# EAGLE board aleph (EAGLE 6.4), part 1 of 3
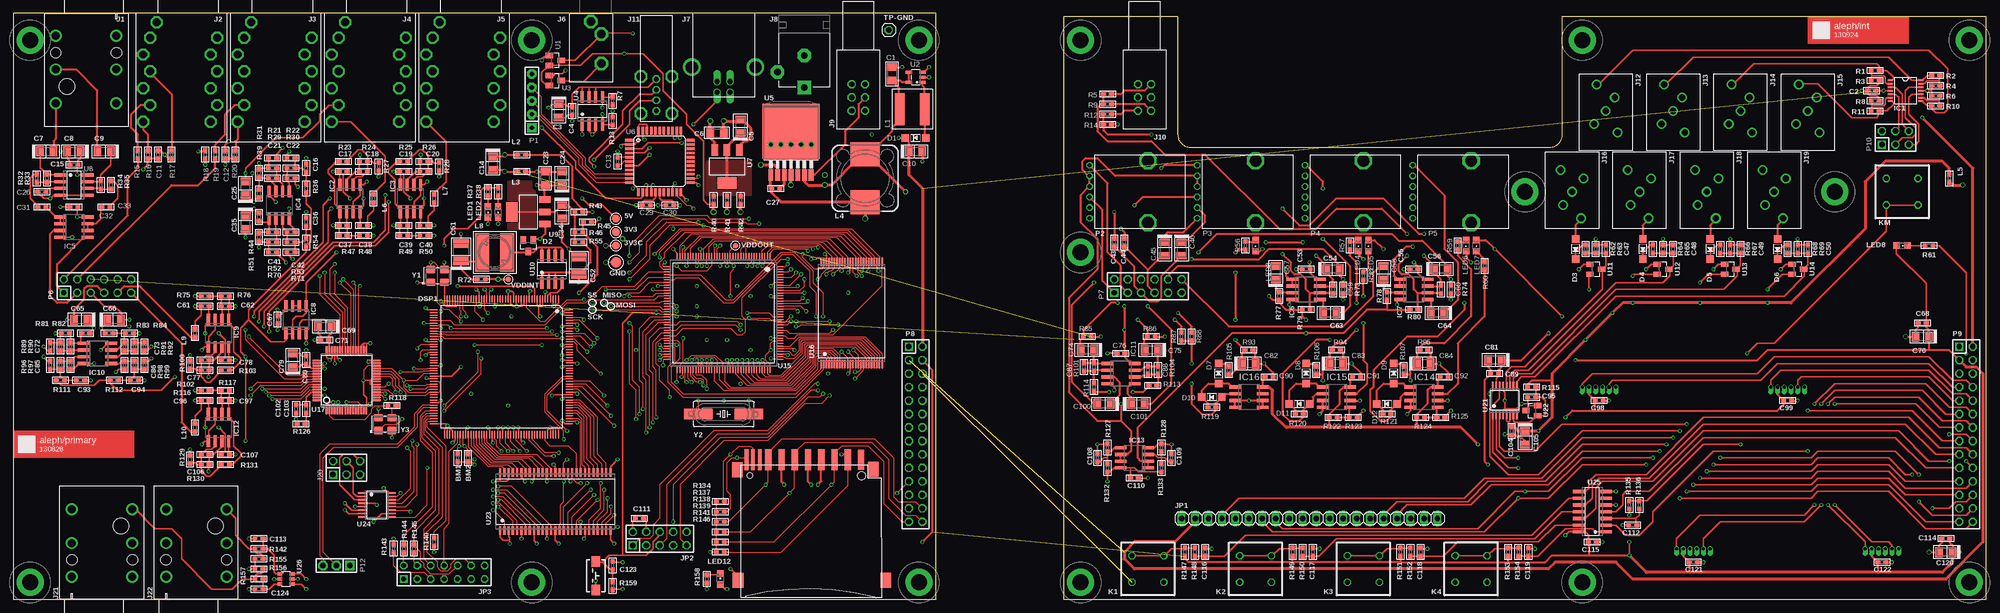
[diagram p10: board, top side]
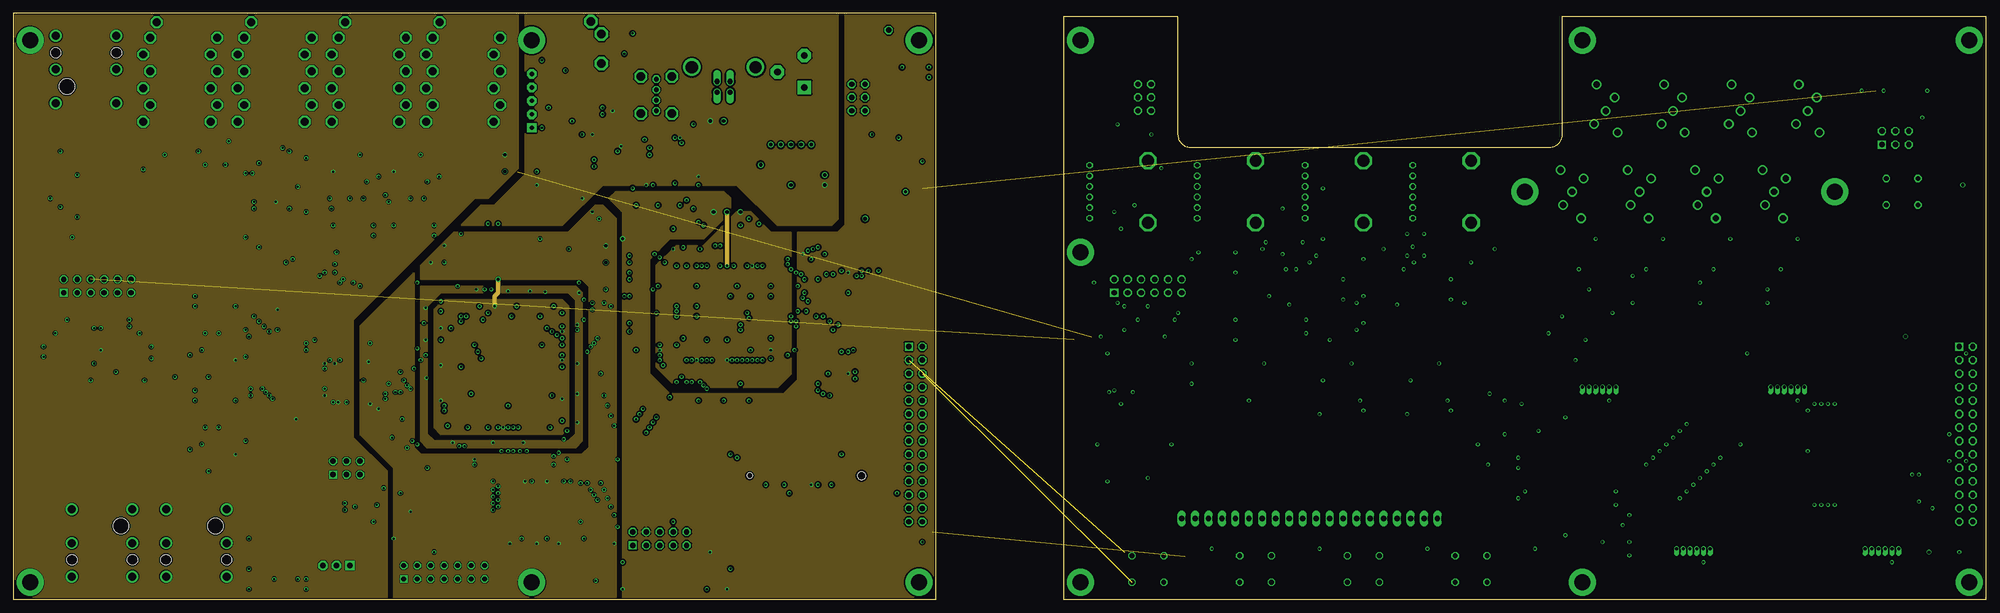
[diagram p11: board, inner layer power]
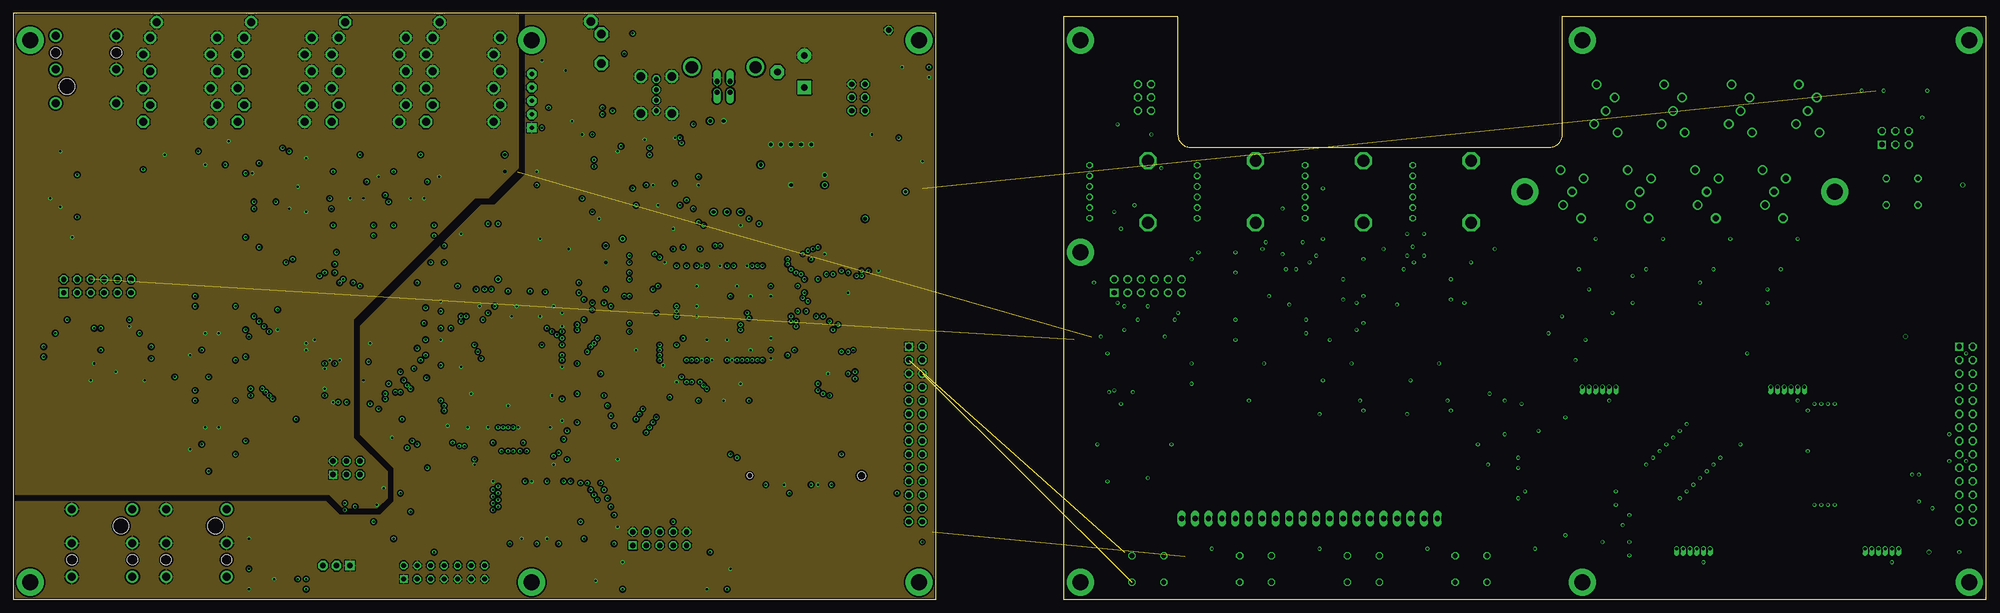
[diagram p12: board, inner layer gnd]
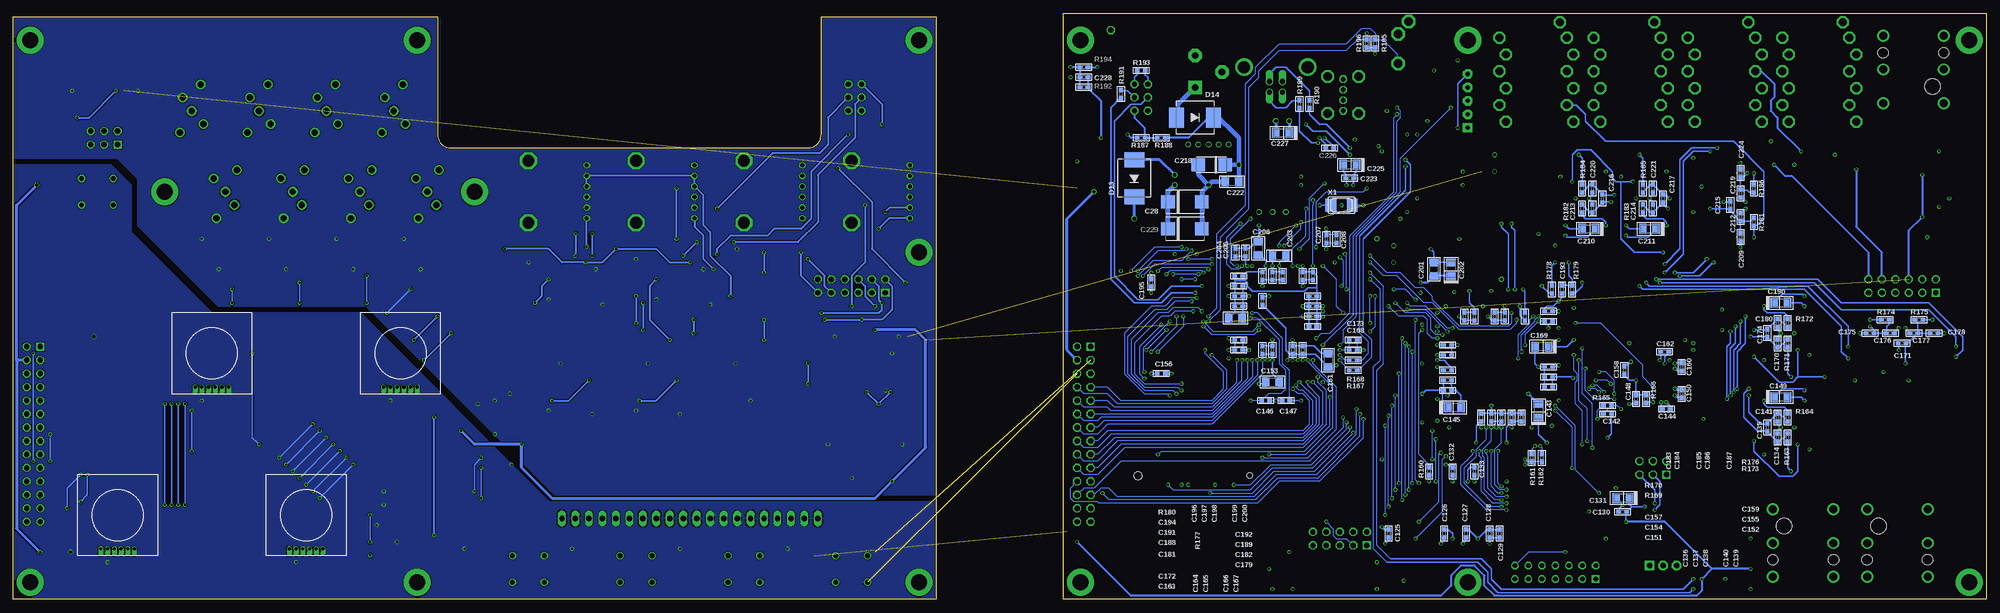
[diagram p13: board, bottom side, seen from below]

Size 372.11 x 110.49 mm. Coordinates in mm from the lower left corner, seen from the top.
Outline: 0,0 173.99,0 173.99,110.49 0,110.49 0,0
Outline: 198.12,0 372.11,0 372.11,109.86 292.1,109.86 292.1,87.63 arc-90 289.56,85.09 222.25,85.09 arc-90 219.71,87.63 219.71,109.86 198.12,109.86 198.12,0
Copper layers (1*2+3*16): Top 0.035mm / dielectric 1.5mm / power 0.035mm / dielectric 0.15mm / gnd 0.035mm / dielectric 0.2mm / Bottom 0.035mm
Design rules "default *": minimum track width 6mil, minimum drill 15mil, track to track 6mil, track to pad 6mil, pad to pad 6mil, via to via 6mil, smd to smd 6mil, copper to edge 10mil, drill to drill 8mil, minimum pad ring 6mil, minimum via ring 6mil, stop-mask expansion 4mil, vias tented up to drill 0mil, thermal gap 10mil

## Footprints (pad centres in the part's own frame; a part is rotated, then mirrored left to right if it is on the bottom)
SMD-15R = smd 1.5 x 1.5: TP 0,0
R0603 = smd 0.9 x 0.8: 1 -0.762,0; 2 0.762,0
C1206 = smd 1.4 x 1.8: 1 -1.27,0; 2 1.27,0
C0603 = smd 0.9 x 0.8: 1 -0.762,0; 2 0.762,0
C1206/T = smd 1.4 x 1.9: + 1.27,0; - -1.27,0
C7343-43 = smd 2.6 x 2.4: + 3.175,0; - -3.175,0
C1210/T = smd 1.6 x 3: + 1.651,0; - -1.651,0
C6032-28/T = smd 2.55 x 2.5: + 2.54,0; - -2.54,0
SOD123 = smd 1.4 x 1.4: A 1.905,0; C -1.905,0
SOT23 = smd 1 x 1.4: 1 -0.95,-1.1; 2 0.95,-1.1; 3 0,1.1
SMC = smd 2.8 x 3.8: A 3.493,0; C -3.493,0
LQFP176 = smd 1.5 x 0.25: P$1 -12.8,10.75; P$2 -12.8,10.25; P$3 -12.8,9.75; P$4 -12.8,9.25; P$5 -12.8,8.75; P$6 -12.8,8.25; P$7 -12.8,7.75; P$8 -12.8,7.25; P$9 -12.8,6.75; P$10 -12.8,6.25; P$11 -12.8,5.75; P$12 -12.8,5.25; P$13 -12.8,4.75; P$14 -12.8,4.25; P$15 -12.8,3.75; P$16 -12.8,3.25; P$17 -12.8,2.75; P$18 -12.8,2.25; P$19 -12.8,1.75; P$20 -12.8,1.25; P$21 -12.8,0.75; P$22 -12.8,0.25; P$23 -12.8,-0.25; P$24 -12.8,-0.75; P$25 -12.8,-1.25; P$26 -12.8,-1.75; P$27 -12.8,-2.25; P$28 -12.8,-2.75; P$29 -12.8,-3.25; P$30 -12.8,-3.75; P$31 -12.8,-4.25; P$32 -12.8,-4.75; P$33 -12.8,-5.25; P$34 -12.8,-5.75; P$35 -12.8,-6.25; P$36 -12.8,-6.75; P$37 -12.8,-7.25; P$38 -12.8,-7.75; P$39 -12.8,-8.25; P$40 -12.8,-8.75; P$41 -12.8,-9.25; P$42 -12.8,-9.75; P$43 -12.8,-10.25; P$44 -12.8,-10.75; P$89 12.8,-10.75; P$90 12.8,-10.25; P$91 12.8,-9.75; P$92 12.8,-9.25; P$93 12.8,-8.75; P$94 12.8,-8.25; P$95 12.8,-7.75; P$96 12.8,-7.25; P$97 12.8,-6.75; P$98 12.8,-6.25; P$99 12.8,-5.75; P$100 12.8,-5.25; P$101 12.8,-4.75; P$102 12.8,-4.25; P$103 12.8,-3.75; P$104 12.8,-3.25; P$105 12.8,-2.75; P$106 12.8,-2.25; P$107 12.8,-1.75; P$108 12.8,-1.25; P$109 12.8,-0.75; P$110 12.8,-0.25; P$111 12.8,0.25; P$112 12.8,0.75; P$113 12.8,1.25; P$114 12.8,1.75; P$115 12.8,2.25; P$116 12.8,2.75; P$117 12.8,3.25; P$118 12.8,3.75; P$119 12.8,4.25; P$120 12.8,4.75; P$121 12.8,5.25; P$122 12.8,5.75; P$123 12.8,6.25; P$124 12.8,6.75; P$125 12.8,7.25; P$126 12.8,7.75; P$127 12.8,8.25; P$128 12.8,8.75; P$129 12.8,9.25; P$130 12.8,9.75; P$131 12.8,10.25; P$132 12.8,10.75 | smd 0.25 x 1.5: P$45 -10.75,-12.8; P$46 -10.25,-12.8; P$47 -9.75,-12.8; P$48 -9.25,-12.8; P$49 -8.75,-12.8; P$50 -8.25,-12.8; P$51 -7.75,-12.8; P$52 -7.25,-12.8; P$53 -6.75,-12.8; P$54 -6.25,-12.8; P$55 -5.75,-12.8; P$56 -5.25,-12.8; P$57 -4.75,-12.8; P$58 -4.25,-12.8; P$59 -3.75,-12.8; P$60 -3.25,-12.8; P$61 -2.75,-12.8; P$62 -2.25,-12.8; P$63 -1.75,-12.8; P$64 -1.25,-12.8; P$65 -0.75,-12.8; P$66 -0.25,-12.8; P$67 0.25,-12.8; P$68 0.75,-12.8; P$69 1.25,-12.8; P$70 1.75,-12.8; P$71 2.25,-12.8; P$72 2.75,-12.8; P$73 3.25,-12.8; P$74 3.75,-12.8; P$75 4.25,-12.8; P$76 4.75,-12.8; P$77 5.25,-12.8; P$78 5.75,-12.8; P$79 6.25,-12.8; P$80 6.75,-12.8; P$81 7.25,-12.8; P$82 7.75,-12.8; P$83 8.25,-12.8; P$84 8.75,-12.8; P$85 9.25,-12.8; P$86 9.75,-12.8; P$87 10.25,-12.8; P$88 10.75,-12.8; P$133 10.75,12.8; P$134 10.25,12.8; P$135 9.75,12.8; P$136 9.25,12.8; P$137 8.75,12.8; P$138 8.25,12.8; P$139 7.75,12.8; P$140 7.25,12.8; P$141 6.75,12.8; P$142 6.25,12.8; P$143 5.75,12.8; P$144 5.25,12.8; P$145 4.75,12.8; P$146 4.25,12.8; P$147 3.75,12.8; P$148 3.25,12.8; P$149 2.75,12.8; P$150 2.25,12.8; P$151 1.75,12.8; P$152 1.25,12.8; P$153 0.75,12.8; P$154 0.25,12.8; P$155 -0.25,12.8; P$156 -0.75,12.8; P$157 -1.25,12.8; P$158 -1.75,12.8; P$159 -2.25,12.8; P$160 -2.75,12.8; P$161 -3.25,12.8; P$162 -3.75,12.8; P$163 -4.25,12.8; P$164 -4.75,12.8; P$165 -5.25,12.8; P$166 -5.75,12.8; P$167 -6.25,12.8; P$168 -6.75,12.8; P$169 -7.25,12.8; P$170 -7.75,12.8; P$171 -8.25,12.8; P$172 -8.75,12.8; P$173 -9.25,12.8; P$174 -9.75,12.8; P$175 -10.25,12.8; P$176 -10.75,12.8
BOURNS-EM14 = drill 0.6 pad 0.813 offset: P$1 -3.175,-6.35; P$2 -1.905,-6.35; P$3 -0.635,-6.35; P$4 0.635,-6.35; P$5 1.905,-6.35; P$6 3.175,-6.35
SMD-20R = smd 2 x 2: TP 0,0
120-PAD-NS = drill 3.048 pad 5.08: B120 0,0
TSSOP14 = smd 0.9 x 0.35: 1 -2.875,1.95; 2 -2.875,1.3; 3 -2.875,0.65; 4 -2.875,0; 5 -2.875,-0.65; 6 -2.875,-1.3; 7 -2.875,-1.95; 8 2.875,-1.95; 9 2.875,-1.3; 10 2.875,-0.65; 11 2.875,0; 12 2.875,0.65; 13 2.875,1.3; 14 2.875,1.95
SO8 = smd 0.6 x 2.2: 1 -1.905,-2.6; 2 -0.635,-2.6; 3 0.635,-2.6; 4 1.905,-2.6; 5 1.905,2.6; 6 0.635,2.6; 7 -0.635,2.6; 8 -1.905,2.6
NEUTRIK-NRJ6HF-1 = drill 1.5: R 7.23,10.6; RN -4.2,10.6; S 7.23,4.25; SN -4.2,4.25; T 7.23,16.95; TN -4.2,16.95 | hole 3: 5.1,13.8 | hole 2: 7.23,7.45; -4.2,7.45
NSJ12HF = drill 1.5 octagon: G -1.73,5.96; RB -10.95,7.23; RNB -10.95,-5.47; RNT -14.13,-4.2; RT -14.13,8.5; SB -4.606,7.23; SNB -4.606,-5.47; SNT -7.78,-4.2; ST -7.78,8.5; TB -17.3,7.23; TNB -17.3,-5.47; TNT -20.48,-4.2; TT -20.48,8.5
SJ1-3533NG = drill 1.6 pad 2.54 octagon: 1 -1,-0.9; 2 1.4,1.1; 3 6.9,1.1
USB_B = drill 0.95 offset: DM -1.25,4.71; DP -1.25,2.71; GND 1.25,2.71; VCC 1.25,4.71 | drill 2.3: MOUNT1 -6,0; MOUNT2 6,0
PJ-102XH = drill 1.245 pad 2.54 square: 1 0,0 | drill 1.245 pad 2.54 octagon: 2 0,-6.032; 3 5.08,-2.857
PHA2U = drill 1 octagon: 0 -1.25,0; 1 -1.25,-2.5; 2 -1.25,2.5; _0 1.25,0; _1 1.25,-2.5; _2 1.25,2.5
USBA-VERT = drill 0.92 octagon: 1 0,-6; 2 0,-4; 3 0,-2; 4 0,0 | drill 1.6 octagon: G1 -2.9,0.5; G2 -2.9,-6.5; G3 2.9,-6.5; G4 2.9,0.5
STX-3680 = drill 1.2: 1 2.2,-4.1; 2 -2.2,-2.5; 3 1.7,2.5; 4 -1.7,5; 5 0,0
DIL-100-2X03 = drill 1.016 square: 1 -2.54,-1.27 | drill 1.016 octagon: 2 -2.54,1.27; 3 0,-1.27; 4 0,1.27; 5 2.54,-1.27; 6 2.54,1.27
1X20 = drill 1.016 long: 1 -24.13,0; 2 -21.59,0; 3 -19.05,0; 4 -16.51,0; 5 -13.97,0; 6 -11.43,0; 7 -8.89,0; 8 -6.35,0; 9 -3.81,0; 10 -1.27,0; 11 1.27,0; 12 3.81,0; 13 6.35,0; 14 8.89,0; 15 11.43,0; 16 13.97,0; 17 16.51,0; 18 19.05,0; 19 21.59,0; 20 24.13,0
AVR-JTAG-10 = drill 1.016 square: 1 -5.08,-1.27 | drill 1.016 octagon: 2 -5.08,1.27; 3 -2.54,-1.27; 4 -2.54,1.27; 5 0,-1.27; 6 0,1.27; 7 2.54,-1.27; 8 2.54,1.27; 9 5.08,-1.27; 10 5.08,1.27
JPQ-07 = drill 0.914 square: 1 -7.62,-1.27 | drill 0.914 octagon: 2 -7.62,1.27; 3 -5.08,-1.27; 4 -5.08,1.27; 5 -2.54,-1.27; 6 -2.54,1.27; 7 0,-1.27; 8 0,1.27; 9 2.54,-1.27; 10 2.54,1.27; 11 5.08,-1.27; 12 5.08,1.27; 13 7.62,-1.27; 14 7.62,1.27
PVA1 = drill 0.9 octagon: 1 -3,-2.5; 2 -3,2.5; 3 3,2.5; 4 3,-2.5
XAL7030-103 = smd 1.778 x 6.096: P$1 -2.362,0; P$2 2.362,0
L0603 = smd 0.9 x 0.8: 1 -0.762,0; 2 0.762,0
MSS1278 = smd 5.5 x 4.5: 1 0,4.5; 2 0,-4.5
SRR6038 = smd 7.3 x 2.6: 1 0,2.35; 2 0,-2.35
CHIPLED_0805 = smd 1.2 x 1.2: A 0,-1.05; C 0,1.05
SIP-100-05-32 = drill 0.813 pad 1.778 square: 1 -5.08,0 | drill 0.813 pad 1.778 octagon: 2 -2.54,0; 3 0,0; 4 2.54,0; 5 5.08,0
EVJ-POT = drill 0.8 octagon: 1 -5,-11; 2 -3,-11; 3 -1,-11; 4 1,-11; 5 3,-11; 6 5,-11 | drill 2.2 octagon: M1 -5.842,0; M2 5.842,0
DIL-100-2X06 = drill 1.016 square: 1 -6.35,-1.27 | drill 1.016 octagon: 2 -6.35,1.27; 3 -3.81,-1.27; 4 -3.81,1.27; 5 -1.27,-1.27; 6 -1.27,1.27; 7 1.27,-1.27; 8 1.27,1.27; 9 3.81,-1.27; 10 3.81,1.27; 11 6.35,-1.27; 12 6.35,1.27
DIL-100-2X14 = drill 1.016 square: 1 -16.51,-1.27 | drill 1.016 octagon: 2 -16.51,1.27; 3 -13.97,-1.27; 4 -13.97,1.27; 5 -11.43,-1.27; 6 -11.43,1.27; 7 -8.89,-1.27; 8 -8.89,1.27; 9 -6.35,-1.27; 10 -6.35,1.27; 11 -3.81,-1.27; 12 -3.81,1.27; 13 -1.27,-1.27; 14 -1.27,1.27; 15 1.27,-1.27; 16 1.27,1.27; 17 3.81,-1.27; 18 3.81,1.27; 19 6.35,-1.27; 20 6.35,1.27; 21 8.89,-1.27; 22 8.89,1.27; 23 11.43,-1.27; 24 11.43,1.27; 25 13.97,-1.27; 26 13.97,1.27; 27 16.51,-1.27; 28 16.51,1.27
SIP-100-03-40 = drill 1.016 pad 1.778 square: 1 -2.54,0 | drill 1.016 pad 1.778 octagon: 2 0,0; 3 2.54,0
06132 = smd 1.2 x 4: 1 6.9,0.9; 2 4.4,0.9; 3 1.9,0.9; 4 -0.6,0.9; 5 -3.1,0.9; 6 -5.6,0.9; 7 -8.1,0.9 | smd 0.7 x 4: 8 -9.7,0.9; CD -11,0.9; WP -12.2,0.9 | smd 1.2 x 3.81: 9 9.4,0.9 | smd 2 x 2.8: GP -13.8,-21.8; GP2 14.1,-21.8; GP3 11.7,-0.9; GP4 -13.9,-1 | hole 1.1: -11.6,-2.1 | hole 1.6: 9.5,-2.1
PANASONIC-EVQ = smd 2 x 1.6: 1 2.7,0; 2 -2.7,0
1X01 = drill 1.016 octagon: 1 0,0
SOT23-5 = smd 0.55 x 1.2: 1 -0.95,-1.3; 2 0,-1.3; 3 0.95,-1.3; 4 0.95,1.3; 5 -0.95,1.3
SO08 = smd 0.6 x 2.2: 1 -1.905,-2.6; 2 -0.635,-2.6; 3 0.635,-2.6; 4 1.905,-2.6; 5 1.905,2.6; 6 0.635,2.6; 7 -0.635,2.6; 8 -1.905,2.6
TO263-7 = smd 0.914 x 2.159: 1 -3.81,-5.715; 2 -2.54,-5.715; 3 -1.27,-5.715; 4 0,-5.715; 5 1.27,-5.715; 6 2.54,-5.715; 7 3.81,-5.715 | smd 10.8 x 10.41: 8 0,2.54
TQFP44 = smd 1.5 x 0.5: 1 -5.8,4; 2 -5.8,3.2; 3 -5.8,2.4; 4 -5.8,1.6; 5 -5.8,0.8; 6 -5.8,0; 7 -5.8,-0.8; 8 -5.8,-1.6; 9 -5.8,-2.4; 10 -5.8,-3.2; 11 -5.8,-4; 23 5.8,-4; 24 5.8,-3.2; 25 5.8,-2.4; 26 5.8,-1.6; 27 5.8,-0.8; 28 5.8,0; 29 5.8,0.8; 30 5.8,1.6; 31 5.8,2.4; 32 5.8,3.2; 33 5.8,4 | smd 0.5 x 1.5: 12 -4,-5.8; 13 -3.2,-5.8; 14 -2.4,-5.8; 15 -1.6,-5.8; 16 -0.8,-5.8; 17 0,-5.8; 18 0.8,-5.8; 19 1.6,-5.8; 20 2.4,-5.8; 21 3.2,-5.8; 22 4,-5.8; 34 4,5.8; 35 3.2,5.8; 36 2.4,5.8; 37 1.6,5.8; 38 0.8,5.8; 39 0,5.8; 40 -0.8,5.8; 41 -1.6,5.8; 42 -2.4,5.8; 43 -3.2,5.8; 44 -4,5.8
SOT223 = smd 1.219 x 2.235: 1 -2.311,-3.099; 2 0,-3.099; 3 2.311,-3.099 | smd 3.6 x 2.2: 4 0,3.099
LQFP144 = smd 0.25 x 1.5: 1 -8.75,-10.6; 2 -8.25,-10.6; 3 -7.75,-10.6; 4 -7.25,-10.6; 5 -6.75,-10.6; 6 -6.25,-10.6; 7 -5.75,-10.6; 8 -5.25,-10.6; 9 -4.75,-10.6; 10 -4.25,-10.6; 11 -3.75,-10.6; 12 -3.25,-10.6; 13 -2.75,-10.6; 14 -2.25,-10.6; 15 -1.75,-10.6; 16 -1.25,-10.6; 17 -0.75,-10.6; 18 -0.25,-10.6; 19 0.25,-10.6; 20 0.75,-10.6; 21 1.25,-10.6; 22 1.75,-10.6; 23 2.25,-10.6; 24 2.75,-10.6; 25 3.25,-10.6; 26 3.75,-10.6; 27 4.25,-10.6; 28 4.75,-10.6; 29 5.25,-10.6; 30 5.75,-10.6; 31 6.25,-10.6; 32 6.75,-10.6; 33 7.25,-10.6; 34 7.75,-10.6; 35 8.25,-10.6; 36 8.75,-10.6; 73 8.75,10.6; 74 8.25,10.6; 75 7.75,10.6; 76 7.25,10.6; 77 6.75,10.6; 78 6.25,10.6; 79 5.75,10.6; 80 5.25,10.6; 81 4.75,10.6; 82 4.25,10.6; 83 3.75,10.6; 84 3.25,10.6; 85 2.75,10.6; 86 2.25,10.6; 87 1.75,10.6; 88 1.25,10.6; 89 0.75,10.6; 90 0.25,10.6; 91 -0.25,10.6; 92 -0.75,10.6; 93 -1.25,10.6; 94 -1.75,10.6; 95 -2.25,10.6; 96 -2.75,10.6; 97 -3.25,10.6; 98 -3.75,10.6; 99 -4.25,10.6; 100 -4.75,10.6; 101 -5.25,10.6; 102 -5.75,10.6; 103 -6.25,10.6; 104 -6.75,10.6; 105 -7.25,10.6; 106 -7.75,10.6; 107 -8.25,10.6; 108 -8.75,10.6 | smd 1.5 x 0.25: 37 10.6,-8.75; 38 10.6,-8.25; 39 10.6,-7.75; 40 10.6,-7.25; 41 10.6,-6.75; 42 10.6,-6.25; 43 10.6,-5.75; 44 10.6,-5.25; 45 10.6,-4.75; 46 10.6,-4.25; 47 10.6,-3.75; 48 10.6,-3.25; 49 10.6,-2.75; 50 10.6,-2.25; 51 10.6,-1.75; 52 10.6,-1.25; 53 10.6,-0.75; 54 10.6,-0.25; 55 10.6,0.25; 56 10.6,0.75; 57 10.6,1.25; 58 10.6,1.75; 59 10.6,2.25; 60 10.6,2.75; 61 10.6,3.25; 62 10.6,3.75; 63 10.6,4.25; 64 10.6,4.75; 65 10.6,5.25; 66 10.6,5.75; 67 10.6,6.25; 68 10.6,6.75; 69 10.6,7.25; 70 10.6,7.75; 71 10.6,8.25; 72 10.6,8.75; 109 -10.6,8.75; 110 -10.6,8.25; 111 -10.6,7.75; 112 -10.6,7.25; 113 -10.6,6.75; 114 -10.6,6.25; 115 -10.6,5.75; 116 -10.6,5.25; 117 -10.6,4.75; 118 -10.6,4.25; 119 -10.6,3.75; 120 -10.6,3.25; 121 -10.6,2.75; 122 -10.6,2.25; 123 -10.6,1.75; 124 -10.6,1.25; 125 -10.6,0.75; 126 -10.6,0.25; 127 -10.6,-0.25; 128 -10.6,-0.75; 129 -10.6,-1.25; 130 -10.6,-1.75; 131 -10.6,-2.25; 132 -10.6,-2.75; 133 -10.6,-3.25; 134 -10.6,-3.75; 135 -10.6,-4.25; 136 -10.6,-4.75; 137 -10.6,-5.25; 138 -10.6,-5.75; 139 -10.6,-6.25; 140 -10.6,-6.75; 141 -10.6,-7.25; 142 -10.6,-7.75; 143 -10.6,-8.25; 144 -10.6,-8.75
TSOP48 = smd 0.3 x 1.6: 1 -5.75,-9.6; 2 -5.25,-9.6; 3 -4.75,-9.6; 4 -4.25,-9.6; 5 -3.75,-9.6; 6 -3.25,-9.6; 7 -2.75,-9.6; 8 -2.25,-9.6; 9 -1.75,-9.6; 10 -1.25,-9.6; 11 -0.75,-9.6; 12 -0.25,-9.6; 13 0.25,-9.6; 14 0.75,-9.6; 15 1.25,-9.6; 16 1.75,-9.6; 17 2.25,-9.6; 18 2.75,-9.6; 19 3.25,-9.6; 20 3.75,-9.6; 21 4.25,-9.6; 22 4.75,-9.6; 23 5.25,-9.6; 24 5.75,-9.6; 25 5.75,9.6; 26 5.25,9.6; 27 4.75,9.6; 28 4.25,9.6; 29 3.75,9.6; 30 3.25,9.6; 31 2.75,9.6; 32 2.25,9.6; 33 1.75,9.6; 34 1.25,9.6; 35 0.75,9.6; 36 0.25,9.6; 37 -0.25,9.6; 38 -0.75,9.6; 39 -1.25,9.6; 40 -1.75,9.6; 41 -2.25,9.6; 42 -2.75,9.6; 43 -3.25,9.6; 44 -3.75,9.6; 45 -4.25,9.6; 46 -4.75,9.6; 47 -5.25,9.6; 48 -5.75,9.6
SQFP-S-10X10-64 = smd 0.3 x 1.6: 1 -3.75,-5.6; 2 -3.25,-5.6; 3 -2.75,-5.6; 4 -2.25,-5.6; 5 -1.75,-5.6; 6 -1.25,-5.6; 7 -0.75,-5.6; 8 -0.25,-5.6; 9 0.25,-5.6; 10 0.75,-5.6; 11 1.25,-5.6; 12 1.75,-5.6; 13 2.25,-5.6; 14 2.75,-5.6; 15 3.25,-5.6; 16 3.75,-5.6; 33 3.75,5.6; 34 3.25,5.6; 35 2.75,5.6; 36 2.25,5.6; 37 1.75,5.6; 38 1.25,5.6; 39 0.75,5.6; 40 0.25,5.6; 41 -0.25,5.6; 42 -0.75,5.6; 43 -1.25,5.6; 44 -1.75,5.6; 45 -2.25,5.6; 46 -2.75,5.6; 47 -3.25,5.6; 48 -3.75,5.6 | smd 1.6 x 0.3: 17 5.6,-3.75; 18 5.6,-3.25; 19 5.6,-2.75; 20 5.6,-2.25; 21 5.6,-1.75; 22 5.6,-1.25; 23 5.6,-0.75; 24 5.6,-0.25; 25 5.6,0.25; 26 5.6,0.75; 27 5.6,1.25; 28 5.6,1.75; 29 5.6,2.25; 30 5.6,2.75; 31 5.6,3.25; 32 5.6,3.75; 49 -5.6,3.75; 50 -5.6,3.25; 51 -5.6,2.75; 52 -5.6,2.25; 53 -5.6,1.75; 54 -5.6,1.25; 55 -5.6,0.75; 56 -5.6,0.25; 57 -5.6,-0.25; 58 -5.6,-0.75; 59 -5.6,-1.25; 60 -5.6,-1.75; 61 -5.6,-2.25; 62 -5.6,-2.75; 63 -5.6,-3.25; 64 -5.6,-3.75
TSSOP16 = smd 0.3 x 1.5: 1 -2.275,-2.8; 2 -1.625,-2.8; 3 -0.975,-2.8; 4 -0.325,-2.8; 5 0.325,-2.8; 6 0.975,-2.8; 7 1.625,-2.8; 8 2.275,-2.8; 9 2.275,2.8; 10 1.625,2.8; 11 0.975,2.8; 12 0.325,2.8; 13 -0.325,2.8; 14 -0.975,2.8; 15 -1.625,2.8; 16 -2.275,2.8
TSOP54 = smd 0.4 x 1.6: 1 -10.4,-5.45; 2 -9.6,-5.45; 3 -8.8,-5.45; 4 -8,-5.45; 5 -7.2,-5.45; 6 -6.4,-5.45; 7 -5.6,-5.45; 8 -4.8,-5.45; 9 -4,-5.45; 10 -3.2,-5.45; 11 -2.4,-5.45; 12 -1.6,-5.45; 13 -0.8,-5.45; 14 0,-5.45; 15 0.8,-5.45; 16 1.6,-5.45; 17 2.4,-5.45; 18 3.2,-5.45; 19 4,-5.45; 20 4.8,-5.45; 21 5.6,-5.45; 22 6.4,-5.45; 23 7.2,-5.45; 24 8,-5.45; 25 8.8,-5.45; 26 9.6,-5.45; 27 10.4,-5.45; 28 10.4,5.45; 29 9.6,5.45; 30 8.8,5.45; 31 8,5.45; 32 7.2,5.45; 33 6.4,5.45; 34 5.6,5.45; 35 4.8,5.45; 36 4,5.45; 37 3.2,5.45; 38 2.4,5.45; 39 1.6,5.45; 40 0.8,5.45; 41 0,5.45; 42 -0.8,5.45; 43 -1.6,5.45; 44 -2.4,5.45; 45 -3.2,5.45; 46 -4,5.45; 47 -4.8,5.45; 48 -5.6,5.45; 49 -6.4,5.45; 50 -7.2,5.45; 51 -8,5.45; 52 -8.8,5.45; 53 -9.6,5.45; 54 -10.4,5.45
SO14 = smd 0.6 x 2.2: 1 -3.81,-2.6; 2 -2.54,-2.6; 3 -1.27,-2.6; 4 0,-2.6; 5 1.27,-2.6; 6 2.54,-2.6; 7 3.81,-2.6; 8 3.81,2.6; 9 2.54,2.6; 10 1.27,2.6; 11 0,2.6; 12 -1.27,2.6; 13 -2.54,2.6; 14 -3.81,2.6
SOT23-6 = smd 0.6 x 0.9: 1 -0.95,-1.15; 2 0,-1.15; 3 0.95,-1.15; 4 0.95,1.15; 5 0,1.15; 6 -0.95,1.15
SMD-10R = smd 1 x 1: TP 0,0
NX5032 = smd 2 x 2.4: P$1 2,0; P$2 -2,0
ASFL1 = smd 1.7 x 1.5: 1 -1.27,-1.2; 2 1.27,-1.2; 3 1.27,1.2; 4 -1.27,1.2
HC49UP@1 = smd 5.334 x 1.93: 1 -4.763,0; 2 4.763,0

## Placement (x,y rotation side)
3V3  TPS-SMD-15R  [SMD-15R]  113.67,69.22 0 top
3V3C  TPS-SMD-15R  [SMD-15R]  113.67,66.67 0 top
5V  TPS-SMD-15R  [SMD-15R]  113.67,71.75 0 top
BM1  DNP  [R0603]  83.82,26.67 90 top
BM2  0  [R0603]  85.72,26.67 90 top
C1  2.2u  [C1206]  165.74,99.06 90 top
C2  100n  [C0603]  350.52,95.89 180 top
C3  4.7u  [C1206/T]  102.87,92.08 90 top
C4  100n  [C0603]  105.41,92.08 90 top
C5  10u  [C1206/T]  137.16,89.22 270 top
C6  100n  [C1206]  132.72,87.95 180 top
C7  68u  [C1206/T]  6.35,84.45 180 top
C8  10u  [C1206/T]  11.43,84.45 0 top
C9  68u  [C1206/T]  17.14,84.45 0 top
C10  4.7u  [C1206/T]  170.18,84.45 180 top
C11  100p  [C0603]  27.3,83.82 90 top
C12  100p  [C0603]  40.01,83.82 90 top
C13  1u  [C0603]  113.98,82.55 270 top
C14  10u  [C1206/T]  90.49,82.23 90 top
C15  100n  [C0603]  11.43,81.92 0 top
C16  680p  [C0603]  55.24,81.28 90 top
C17  100n  [C0603]  62.23,80.64 180 top
C18  120p  [C0603]  66.04,80.64 0 top
C19  100n  [C0603]  73.66,80.64 180 top
C20  120p  [C0603]  77.47,80.64 0 top
C21  100p  [C0603]  48.9,79.38 180 top
C22  220p  [C0603]  52.39,79.38 180 top
C23  100n  [C1206]  100.33,79.38 270 top
C24  10u  [C1206/T]  103.5,79.38 270 top
C25  10u  [C1206/T]  43.81,77.47 270 top
C26  100n  [C0603]  5.4,76.83 0 top
C27  10n  [C0603]  143.83,77.47 0 top
C28  100u  [C7343-43]  151.13,74.93 180 bottom
C29  8p  [C0603]  119.38,74.3 180 top
C30  8p  [C0603]  123.83,74.3 0 top
C31  1u  [C0603]  5.4,73.98 0 top
C32  100n  [C0603]  11.43,73.98 0 top
C33  1u  [C0603]  17.46,73.98 180 top
C34  10u  [C1206/T]  103.5,73.03 90 top
C35  10u  [C1206/T]  43.81,71.12 90 top
C36  680p  [C0603]  55.24,71.12 90 top
C37  120p  [C0603]  62.23,70.48 0 top
C38  100p  [C0603]  66.04,70.48 0 top
C39  120p  [C0603]  73.66,70.48 0 top
C40  100p  [C0603]  77.47,70.48 0 top
C41  100p  [C0603]  48.9,69.22 180 top
C42  220p  [C0603]  52.39,69.22 180 top
C43  1u  [C0603]  207.65,67.31 270 top
C44  1u  [C0603]  209.55,67.31 270 top
C45  10u  [C1206/T]  217.17,66.04 90 top
C46  10u  [C1206/T]  220.34,66.04 90 top
C47  10n  [C0603]  300.36,66.04 90 top
C48  10n  [C0603]  313.06,66.04 90 top
C49  10n  [C0603]  325.75,66.04 90 top
C50  10n  [C0603]  338.45,66.04 90 top
C51  100u  [C1210/T]  84.45,65.41 270 top
C52  100u  [C1210/T]  106.68,62.87 270 top
C53  100n  [C0603]  243.84,62.23 0 top
C54  10u  [C1206/T]  248.92,62.23 180 top
C55  100n  [C0603]  264.16,62.23 0 top
C56  10u  [C1206/T]  269.24,62.23 180 top
C57  10u  [C1206/T]  238.12,61.59 270 top
C58  10u  [C1206/T]  258.44,61.59 270 top
C59  100p  [C0603]  248.92,58.42 270 top
C60  100p  [C0603]  269.24,58.42 270 top
C61  100p  [C0603]  36.2,55.24 180 top
C62  120p  [C0603]  40.01,55.24 180 top
C63  10u  [C1206/T]  248.28,53.98 0 top
C64  10u  [C1206/T]  268.61,53.98 0 top
C65  10u  [C1206/T]  12.7,52.7 0 top
C66  10u  [C1206/T]  19.05,52.7 180 top
C67  100n  [C0603]  49.85,52.7 90 top
C68  100n  [C0603]  360.05,52.07 0 top
C69  10u  [C1206/T]  58.74,51.44 0 top
C70  10u  [C1206/T]  360.05,49.53 0 top
C71  100n  [C0603]  58.74,48.9 0 top
C72  100p  [C0603]  10.79,47.62 90 top
C73  100p  [C0603]  20.95,47.62 90 top
C74  10u  [C1206/T]  202.56,46.99 0 top
C75  10u  [C1206/T]  214.63,46.99 0 top
C76  100n  [C0603]  208.91,46.35 0 top
C77  120p  [C0603]  36.2,45.09 180 top
C78  100n  [C0603]  40.01,45.09 0 top
C79  47u  [C1206/T]  52.7,45.09 270 top
C80  100n  [C0603]  55.24,45.09 270 top
C81  10u  [C1206/T]  279.4,45.09 0 top
C82  10u  [C1206/T]  233.04,44.45 180 top
C83  10u  [C1206/T]  249.56,44.45 180 top
C84  10u  [C1206/T]  266.06,44.45 180 top
C85  220p  [C0603]  10.79,44.13 90 top
C86  220p  [C0603]  20.95,44.13 90 top
C87  100p  [C0603]  201.93,43.81 90 top
C88  100p  [C0603]  214,43.18 90 top
C89  100n  [C0603]  279.4,42.55 0 top
C90  100n  [C0603]  236.85,41.91 180 top
C91  100n  [C0603]  253.37,41.91 180 top
C92  100n  [C0603]  269.88,41.91 180 top
C93  680p  [C0603]  12.7,41.27 0 top
C94  680p  [C0603]  22.86,41.27 0 top
C95  100n  [C0603]  286.38,38.1 0 top
C96  100p  [C0603]  36.2,37.47 180 top
C97  120p  [C0603]  40.01,37.47 180 top
C98  100n  [C0603]  299.08,37.47 180 top
C99  100n  [C0603]  334.64,37.47 180 top
C100  10u  [C1206/T]  205.74,36.83 0 top
C101  10u  [C1206/T]  212.09,36.83 180 top
C102  390p  [C0603]  53.34,35.88 90 top
C103  5600p  [C0603]  55.24,35.88 90 top
C104  100n  [C0603]  282.57,31.75 90 top
C105  10u  [C1206/T]  285.12,30.48 90 top
C106  120p  [C0603]  36.2,27.3 180 top
C107  100n  [C0603]  40.01,27.3 0 top
C108  100n  [C0603]  204.47,26.67 270 top
C109  100n  [C0603]  218.44,26.67 270 top
C110  100n  [C0603]  211.46,22.86 180 top
C111  100n  [C0603]  118.11,15.24 180 top
C112  1u  [C0603]  305.44,13.97 0 top
C113  1u  [C0603]  46.35,11.43 0 top
C114  100n  [C0603]  364.49,11.43 0 top
C115  100n  [C0603]  297.81,10.79 180 top
C116  1u  [C0603]  224.79,8.89 270 top
C117  1u  [C0603]  245.11,8.89 270 top
C118  1u  [C0603]  265.43,8.89 270 top
C119  1u  [C0603]  285.75,8.89 270 top
C120  10u  [C1206/T]  364.49,8.89 0 top
C121  100n  [C0603]  316.87,6.99 180 top
C122  100n  [C0603]  352.43,6.99 180 top
C123  100n  [C0603]  113.03,6.35 90 top
C124  1u  [C0603]  46.35,1.91 0 top
C125  10n  [C0603]  112.71,12.38 270 bottom
C126  10n  [C0603]  102.23,12.38 270 bottom
C127  10n  [C0603]  98.11,12.38 270 bottom
C128  10n  [C0603]  93.66,12.38 270 bottom
C129  10n  [C0603]  91.76,12.38 270 bottom
C130  100n  [C0603]  68.58,16.51 180 bottom
C131  10u  [C1206/T]  68.58,19.05 0 bottom
C132  10n  [C0603]  100.65,24.13 270 bottom
C133  10n  [C0603]  96.52,24.13 270 bottom
C134  1n  [C0603]  39.37,30.48 270 bottom
C135  100p  [C0603]  41.27,32.38 270 bottom
C136  100n  [C0603]  95.25,34.29 270 bottom
C137  100n  [C0603]  93.34,34.29 270 bottom
C138  10n  [C0603]  91.44,34.29 270 bottom
C139  100n  [C0603]  89.53,34.29 270 bottom
C140  10n  [C0603]  87.63,34.29 270 bottom
C141  1n  [C0603]  39.37,34.29 270 bottom
C142  10n  [C0603]  71.44,34.92 0 bottom
C143  10u  [C1206/T]  84.45,35.56 270 bottom
C144  100n  [C0603]  60.33,35.88 0 bottom
C145  10u  [C1206/T]  100.33,36.2 180 bottom
C146  22p  [C0603]  135.89,37.47 0 bottom
C147  22p  [C0603]  132.08,37.47 180 bottom
C148  100n  [C0603]  66.04,37.78 90 bottom
C149  4.7u  [C1206/T]  38.73,38.1 180 bottom
C150  100n  [C0603]  57.47,38.73 90 bottom
C151  10n  [C0603]  101.6,39.37 180 bottom
C152  10n  [C0603]  82.55,40.01 0 bottom
C153  4.7u  [C1206]  134.62,40.96 180 bottom
C154  100n  [C0603]  101.6,41.27 180 bottom
C155  100n  [C0603]  82.55,41.91 0 bottom
C156  10n  [C0603]  155.57,42.55 0 bottom
C157  100n  [C0603]  101.6,43.18 0 bottom
C158  100n  [C0603]  68.26,43.18 270 bottom
C159  100n  [C0603]  82.55,43.81 0 bottom
C160  100n  [C0603]  57.47,43.81 270 bottom
C161  2.2u  [C1206]  124.14,45.09 90 bottom
C162  100n  [C0603]  60.64,46.67 180 bottom
C163  33n  [C0603]  140.97,46.99 0 bottom
C164  100n  [C0603]  136.53,46.99 90 bottom
C165  33n  [C0603]  134.62,46.99 90 bottom
C166  2.7n  [C0603]  130.81,46.99 90 bottom
C167  33n  [C0603]  128.91,46.99 90 bottom
C168  33n  [C0603]  119.38,46.99 0 bottom
C169  10u  [C1206/T]  83.82,47.62 0 bottom
C170  1n  [C0603]  39.37,48.26 270 bottom
C171  100n  [C0603]  15.88,48.26 180 bottom
C172  100n  [C0603]  140.97,48.9 0 bottom
C173  100n  [C0603]  119.38,48.9 0 bottom
C174  100p  [C0603]  41.27,50.16 270 bottom
C175  330p  [C0603]  21.91,50.16 180 bottom
C176  2200p  [C0603]  18.1,50.16 0 bottom
C177  2200p  [C0603]  13.65,50.16 180 bottom
C178  330p  [C0603]  9.84,50.16 0 bottom
C179  33n  [C0603]  127,51.44 180 bottom
C180  1n  [C0603]  39.37,52.07 270 bottom
C181  2.2u  [C1206]  141.6,53.02 0 bottom
C182  2.7n  [C0603]  127,53.34 180 bottom
C183  100n  [C0603]  98.42,53.34 90 bottom
C184  10n  [C0603]  96.52,53.34 90 bottom
C185  10n  [C0603]  92.71,53.34 90 bottom
C186  100n  [C0603]  90.81,53.34 90 bottom
C187  100n  [C0603]  87,53.34 90 bottom
C188  100n  [C0603]  140.97,55.24 0 bottom
C189  33n  [C0603]  127,55.24 180 bottom
C190  4.7u  [C1206/T]  38.73,55.88 180 bottom
C191  33n  [C0603]  140.97,57.15 0 bottom
C192  2.7n  [C0603]  127,57.15 180 bottom
C193  10n  [C0603]  80.01,58.42 270 bottom
C194  2.7n  [C0603]  140.97,59.05 0 bottom
C195  10n  [C0603]  157.48,59.69 270 bottom
C196  470p  [C0603]  136.53,60.96 270 bottom
C197  33n  [C0603]  134.62,60.96 270 bottom
C198  100n  [C0603]  132.72,60.96 270 bottom
C199  2.7n  [C0603]  128.91,60.96 270 bottom
C200  33n  [C0603]  127,60.96 270 bottom
C201  100n  [C1206]  104.14,62.23 270 bottom
C202  10u  [C1206/T]  100.97,62.23 270 bottom
C203  4.7u  [C1206]  133.35,64.77 0 bottom
C204  100n  [C0603]  141.6,65.41 90 bottom
C205  33n  [C0603]  139.7,65.41 90 bottom
C206  2.2u  [C1206]  137.32,66.2 90 bottom
C207  33n  [C0603]  124.46,67.94 90 bottom
C208  100n  [C0603]  122.56,67.94 90 bottom
C209  330p  [C0603]  46.35,68.26 270 bottom
C210  4.7u  [C1206/T]  74.93,69.85 0 bottom
C211  4.7u  [C1206/T]  63.5,69.85 0 bottom
C212  2200p  [C0603]  46.35,72.07 90 bottom
C213  1n  [C0603]  74.3,73.66 90 bottom
C214  1n  [C0603]  62.87,73.66 90 bottom
C215  100n  [C0603]  48.26,74.3 90 bottom
C216  100p  [C0603]  72.39,75.56 90 bottom
C217  100p  [C0603]  60.96,75.56 90 bottom
C218  22u  [C6032-28/T]  146.05,81.92 0 bottom
C219  2200p  [C0603]  46.35,76.52 270 bottom
C220  1n  [C0603]  74.3,77.47 90 bottom
C221  1n  [C0603]  62.87,77.47 90 bottom
C222  100n  [C1206]  142.24,78.74 0 bottom
C223  100n  [C0603]  120.02,79.38 0 bottom
C224  330p  [C0603]  46.35,80.33 90 bottom
C225  10u  [C1206/T]  120.02,81.92 0 bottom
C226  100n  [C0603]  123.83,85.09 180 bottom
C227  10u  [C1206/T]  132.72,87.95 0 bottom
C228  220p  [C0603]  170.18,98.42 0 bottom
C229  100u  [C7343-43]  151.13,69.85 180 bottom
D1  MBR0520L  [SOD123]  170.18,87 0 top
D2  zhcs1000  [SOT23]  97.16,66.67 180 top
D3  1N4148W-7  [SOD123]  294.64,66.04 90 top
D4  1N4148W-7  [SOD123]  307.34,66.04 90 top
D5  1N4148W-7  [SOD123]  320.04,66.04 90 top
D6  1N4148W-7  [SOD123]  332.74,66.04 90 top
D7  1N4148W-7  [SOD123]  227.33,42.55 270 top
D8  1N4148W-7  [SOD123]  243.84,42.55 270 top
D9  1N4148W-7  [SOD123]  260.35,42.55 270 top
D10  1N4148W-7  [SOD123]  226.06,38.1 0 top
D11  1N4148W-7  [SOD123]  242.57,36.83 0 top
D12  1N4148W-7  [SOD123]  259.08,36.83 0 top
D13  MBRS360T3  [SMC]  160.66,79.38 90 bottom
D14  MBRS360T3  [SMC]  149.22,90.81 180 bottom
DSP1  BF533  [LQFP176]  92.08,43.81 270 top
E1  BOURNS-EM14  [BOURNS-EM14]  352.43,15.88 0 bottom
E2  BOURNS-EM14  [BOURNS-EM14]  316.87,15.88 0 bottom
E3  BOURNS-EM14  [BOURNS-EM14]  299.08,46.35 0 bottom
E4  BOURNS-EM14  [BOURNS-EM14]  334.65,46.36 0 bottom
GND  TPS-SMD-20R  [SMD-20R]  113.67,63.5 0 top
H1  MOUNT440  [120-PAD-NS]  3.17,105.41 0 top
H2  MOUNT440  [120-PAD-NS]  97.79,105.41 0 top
H3  MOUNT440  [120-PAD-NS]  170.81,105.41 0 top
H4  MOUNT440  [120-PAD-NS]  201.29,105.41 0 top
H5  MOUNT440  [120-PAD-NS]  295.91,105.41 0 top
H6  MOUNT440  [120-PAD-NS]  368.94,105.41 0 top
H7  MOUNT440  [120-PAD-NS]  285.12,76.83 0 top
H8  MOUNT440  [120-PAD-NS]  343.54,76.83 0 top
H9  MOUNT440  [120-PAD-NS]  201.29,65.41 0 top
H10  MOUNT440  [120-PAD-NS]  3.17,3.17 0 top
H11  MOUNT440  [120-PAD-NS]  97.79,3.17 0 top
H12  MOUNT440  [120-PAD-NS]  170.81,3.17 0 top
H13  MOUNT440  [120-PAD-NS]  201.29,3.17 0 top
H14  MOUNT440  [120-PAD-NS]  295.91,3.17 0 top
H15  MOUNT440  [120-PAD-NS]  368.94,3.17 0 top
IC1  AD8567  [TSSOP14]  356.87,95.89 0 top
IC2  AD8606  [SO8]  63.5,75.56 0 top
IC3  AD8606  [SO8]  74.93,75.56 0 top
IC4  AD8606  [SO8]  50.16,74.3 0 top
IC5  AD8606  [SO8]  11.43,70.17 270 top
IC6  AD8606  [SO8]  243.84,58.42 270 top
IC7  AD8606  [SO8]  264.16,58.42 270 top
IC8  AD8606  [SO8]  53.34,52.7 0 top
IC9  AD8606  [SO8]  38.73,50.16 180 top
IC10  AD8606  [SO8]  15.88,46.35 270 top
IC11  AD8606  [SO8]  208.91,42.55 270 top
IC12  AD8606  [SO8]  38.73,32.38 180 top
IC13  AD8606  [SO8]  211.46,26.67 90 top
IC14  AD8606  [SO8]  266.06,38.1 270 top
IC15  AD8606  [SO8]  249.56,38.1 270 top
IC16  AD8606  [SO8]  233.04,38.1 270 top
J1  STEREOSW3GND  [NEUTRIK-NRJ6HF-1]  15.24,110.49 180 top
J2  NSJ12HF  [NSJ12HF]  33.02,110.49 90 top
J3  NSJ12HF  [NSJ12HF]  50.8,110.49 90 top
J4  NSJ12HF  [NSJ12HF]  68.58,110.49 90 top
J5  NSJ12HF  [NSJ12HF]  86.36,110.49 90 top
J6  SJ1-3533NG  [SJ1-3533NG]  109.86,107.95 270 top
J7  [USB_B]  133.99,100.33 180 top
J8  PJ-102AH/BH  [PJ-102XH]  149.22,96.52 180 top
J9  PHA2U  [PHA2U]  159.38,94.61 180 top
J10  PHA2U  [PHA2U]  213.36,94.61 180 top
J11  USBA-VERT  [USBA-VERT]  121.28,92.08 180 top
J12  STX-3680  [STX-3680]  300.36,92.08 0 top
J13  STX-3680  [STX-3680]  313.06,92.08 0 top
J14  STX-3680  [STX-3680]  325.75,92.08 0 top
J15  STX-3680  [STX-3680]  338.45,92.08 0 top
J16  STX-3680  [STX-3680]  294,76.83 180 top
J17  STX-3680  [STX-3680]  306.7,76.83 180 top
J18  STX-3680  [STX-3680]  319.4,76.83 180 top
J19  STX-3680  [STX-3680]  332.11,76.83 180 top
J20  F-2X03-DIL-100  [DIL-100-2X03]  62.87,24.77 0 top
J21  STEREOSW3GND  [NEUTRIK-NRJ6HF-1]  15.24,0 0 top
J22  STEREOSW3GND  [NEUTRIK-NRJ6HF-1]  33.02,0 0 top
JP1  OLED  [1X20]  244.47,15.24 0 top
JP2  AVR-JTAG  [AVR-JTAG-10]  121.92,11.43 0 top
JP3  JPQ-07-100  [JPQ-07]  81.28,5.08 0 top
K1  PVA1  [PVA1]  214,5.71 180 top
K2  PVA1  [PVA1]  234.31,5.71 180 top
K3  PVA1  [PVA1]  254.63,5.71 180 top
K4  PVA1  [PVA1]  274.95,5.71 180 top
KM  PVA1  [PVA1]  356.24,76.83 0 top
L1  XAL7030-103  [XAL7030-103]  169.54,92.39 0 top
L2  600  [L0603]  95.89,83.82 0 top
L3  600  [L0603]  95.89,80.64 0 top
L4  MSS1278  [MSS1278]  160.66,79.38 180 top
L5  600  [L0603]  365.12,79.38 270 top
L6  600  [L0603]  67.94,75.56 90 top
L7  600  [L0603]  79.38,75.56 90 top
L8  SRR6038-100Y  [SRR6038]  90.81,65.41 270 top
L9  600  [L0603]  34.29,50.16 270 top
L10  600  [L0603]  34.29,32.38 270 top
LED1  [CHIPLED_0805]  89.53,73.03 180 top
LED2  [CHIPLED_0805]  91.44,73.03 180 top
LED3  [CHIPLED_0805]  234.31,66.67 180 top
LED4  [CHIPLED_0805]  253.68,66.67 180 top
LED5  [CHIPLED_0805]  255.59,66.67 180 top
LED6  [CHIPLED_0805]  274,66.67 180 top
LED7  [CHIPLED_0805]  275.91,66.67 180 top
LED8  [CHIPLED_0805]  356.24,66.67 270 top
LED12  [CHIPLED_0805]  133.35,3.81 0 top
P1  M-1X05-SIP-100-32  [SIP-100-05-32]  97.79,93.98 90 top
P2  EVJ-POT  [EVJ-POT]  214,76.83 270 top
P3  EVJ-POT  [EVJ-POT]  234.31,76.83 270 top
P4  EVJ-POT  [EVJ-POT]  254.63,76.83 270 top
P5  EVJ-POT  [EVJ-POT]  274.95,76.83 270 top
P6  F-2X06-DIL-100  [DIL-100-2X06]  15.88,59.05 0 top
P7  M-2X06-DIL-100  [DIL-100-2X06]  214,59.05 0 top
P8  M-2X14-DIL-100  [DIL-100-2X14]  170.18,31.11 270 top
P9  M-2X14-DIL-100  [DIL-100-2X14]  368.3,31.11 270 top
P10  M-2X03-DIL-100  [DIL-100-2X03]  354.96,87 0 top
P12  M-1X03-SIP-100-40  [SIP-100-03-40]  60.96,6.35 180 top
R1  20k  [R0603]  351.15,99.69 180 top
R2  20k  [R0603]  362.58,98.74 0 top
R3  10k  [R0603]  351.15,97.79 0 top
R4  10k  [R0603]  362.58,96.84 180 top
R5  10k  [R0603]  206.38,95.25 0 top
R6  10k  [R0603]  362.58,94.93 180 top
R7  47k  [R0603]  113.03,93.98 270 top
R8  10k  [R0603]  351.15,93.98 0 top
R9  47k  [R0603]  206.38,93.34 0 top
R10  20k  [R0603]  362.58,93.03 0 top
R11  20k  [R0603]  351.15,92.08 180 top
R12  47k  [R0603]  206.38,91.44 0 top
R13  47k  [R0603]  113.03,90.17 90 top
R14  10k  [R0603]  206.38,89.53 0 top
R15  120  [R0603]  23.5,83.82 270 top
R16  120  [R0603]  25.4,83.82 270 top
R17  120  [R0603]  29.84,83.82 270 top
R18  120  [R0603]  36.2,83.82 270 top
R19  120  [R0603]  38.1,83.82 270 top
R20  120  [R0603]  41.91,83.82 270 top
R21  11k  [R0603]  48.9,83.19 0 top
R22  5k49  [R0603]  52.39,83.19 180 top
R23  5k76  [R0603]  62.23,82.55 180 top
R24  5k76  [R0603]  66.04,82.55 0 top
R25  5k76  [R0603]  73.66,82.55 180 top
R26  5k76  [R0603]  77.47,82.55 0 top
R27  750k  [R0603]  68.9,81.6 270 top
R28  750k  [R0603]  80.33,81.6 270 top
R29  3k32  [R0603]  48.9,81.28 180 top
R30  1k65  [R0603]  52.39,81.28 180 top
R31  5k49  [R0603]  46.35,80.33 90 top
R32  20k  [R0603]  4.45,79.38 270 top
R33  20k  [R0603]  6.35,79.38 90 top
R34  20k  [R0603]  16.51,78.11 270 top
R35  20k  [R0603]  18.41,78.11 90 top
R36  2k74  [R0603]  55.24,77.47 270 top
R37  150  [R0603]  89.53,76.83 90 top
R38  150  [R0603]  91.44,76.83 90 top
R39  604  [R0603]  46.35,76.52 270 top
R40  0  [R0603]  132.08,75.25 90 top
R41  0  [R0603]  134.62,75.25 90 top
R42  0  [R0603]  137.16,75.25 90 top
R43  0  [R0603]  106.68,73.03 180 top
R44  604  [R0603]  46.35,72.07 90 top
R45  3k32  [R0603]  108.27,71.12 0 top
R46  0  [R0603]  106.68,69.22 180 top
R47  5k76  [R0603]  62.23,68.58 0 top
R48  5k76  [R0603]  66.04,68.58 0 top
R49  5k76  [R0603]  73.66,68.58 0 top
R50  5k76  [R0603]  77.47,68.58 0 top
R51  5k49  [R0603]  46.35,68.26 270 top
R52  3k32  [R0603]  48.9,67.31 180 top
R53  1k65  [R0603]  52.39,67.31 180 top
R54  2k74  [R0603]  55.24,67.31 270 top
R55  0  [R0603]  106.68,67.31 180 top
R56  270  [R0603]  232.41,66.67 90 top
R57  270  [R0603]  252.09,66.67 90 top
R58  270  [R0603]  254.63,60.96 90 top
R59  270  [R0603]  272.42,66.67 90 top
R60  270  [R0603]  277.5,62.87 90 top
R61  150  [R0603]  361.31,66.67 180 top
R62  10k  [R0603]  296.55,66.04 90 top
R63  10k  [R0603]  298.45,66.04 90 top
R64  10k  [R0603]  309.25,66.04 90 top
R65  10k  [R0603]  311.15,66.04 90 top
R66  10k  [R0603]  321.94,66.04 90 top
R67  10k  [R0603]  323.85,66.04 90 top
R68  10k  [R0603]  334.64,66.04 90 top
R69  10k  [R0603]  336.55,66.04 90 top
R70  11k  [R0603]  48.9,65.41 0 top
R71  5k49  [R0603]  52.39,65.41 180 top
R72  0  [R0603]  88.27,60.33 180 top
R73  100k  [R0603]  250.82,58.42 90 top
R74  100k  [R0603]  271.14,58.42 90 top
R75  5k76  [R0603]  36.2,57.15 180 top
R76  5k76  [R0603]  40.01,57.15 180 top
R77  470k  [R0603]  238.76,57.15 90 top
R78  470k  [R0603]  259.08,57.15 90 top
R79  4k7  [R0603]  243.84,54.61 0 top
R80  4k7  [R0603]  264.16,54.61 0 top
R81  5k49  [R0603]  9.84,50.16 180 top
R82  604  [R0603]  13.65,50.16 0 top
R83  604  [R0603]  18.1,50.16 180 top
R84  5k49  [R0603]  21.91,50.16 0 top
R85  100k  [R0603]  202.56,49.53 180 top
R86  100k  [R0603]  214.63,49.53 180 top
R87  1k  [R0603]  220.34,49.53 90 top
R88  1k  [R0603]  222.25,49.53 90 top
R89  11k  [R0603]  6.99,47.62 270 top
R90  3k32  [R0603]  8.89,47.62 90 top
R91  3k32  [R0603]  22.86,47.62 90 top
R92  11k  [R0603]  24.77,47.62 270 top
R93  10k  [R0603]  233.04,46.99 0 top
R94  10k  [R0603]  249.56,46.99 0 top
R95  10k  [R0603]  266.06,46.99 0 top
R96  5k49  [R0603]  6.99,44.13 90 top
R97  1k65  [R0603]  8.89,44.13 90 top
R98  1k65  [R0603]  22.86,44.13 90 top
R99  5k49  [R0603]  24.77,44.13 90 top
R100  750k  [R0603]  33.34,44.13 90 top
R101  10k  [R0603]  203.84,43.81 90 top
R102  5k76  [R0603]  36.2,43.18 180 top
R103  5k76  [R0603]  40.01,43.18 0 top
R104  10k  [R0603]  215.9,43.18 90 top
R105  270  [R0603]  229.24,43.18 90 top
R106  270  [R0603]  245.75,43.18 90 top
R107  270  [R0603]  262.25,43.18 90 top
R111  2k74  [R0603]  8.89,41.27 180 top
R112  2k74  [R0603]  19.05,41.27 180 top
R113  4k7  [R0603]  214.95,40.32 0 top
R114  4k7  [R0603]  203.84,40.01 90 top
R115  1k  [R0603]  286.38,40.01 0 top
R116  5k76  [R0603]  36.2,39.37 180 top
R117  5k76  [R0603]  40.01,39.37 180 top
R118  33  [R0603]  71.44,36.51 0 top
R119  47k  [R0603]  226.06,36.2 0 top
R120  47k  [R0603]  242.57,34.92 0 top
R121  47k  [R0603]  259.08,34.92 0 top
R122  56k  [R0603]  248.92,34.29 0 top
R123  100k  [R0603]  252.73,34.29 0 top
R124  56k  [R0603]  265.43,34.29 0 top
R125  100k  [R0603]  269.24,34.29 0 top
R126  562  [R0603]  54.29,33.02 180 top
R127  100k  [R0603]  206.38,28.57 270 top
R128  100k  [R0603]  216.53,28.57 270 top
R129  750k  [R0603]  33.34,26.35 90 top
R130  5k76  [R0603]  36.2,25.4 180 top
R131  5k76  [R0603]  40.01,25.4 0 top
R132  100k  [R0603]  206.38,24.77 270 top
R133  100k  [R0603]  216.53,24.77 270 top
R134  100k  [R0603]  133.35,18.41 180 top
R135  82k  [R0603]  304.8,17.78 90 top
R136  18k  [R0603]  306.7,17.78 90 top
R137  100k  [R0603]  133.35,16.51 180 top
R138  100k  [R0603]  133.35,14.61 180 top
R139  100k  [R0603]  133.35,12.7 180 top
R140  0  [R0603]  79.38,10.79 270 top
R141  100k  [R0603]  133.35,10.79 180 top
R142  18k  [R0603]  46.35,9.53 0 top
R143  4k7  [R0603]  71.75,9.53 270 top
R144  0  [R0603]  73.66,9.53 270 top
R145  4k7  [R0603]  75.56,9.53 270 top
R146  100k  [R0603]  133.35,8.89 180 top
R147  82k  [R0603]  220.98,8.89 90 top
R148  18k  [R0603]  222.88,8.89 270 top
R149  82k  [R0603]  241.3,8.89 90 top
R150  18k  [R0603]  243.21,8.89 270 top
R151  82k  [R0603]  261.62,8.89 90 top
R152  18k  [R0603]  263.52,8.89 90 top
R153  82k  [R0603]  281.94,8.89 90 top
R154  18k  [R0603]  283.85,8.89 90 top
R155  82k  [R0603]  46.35,7.62 0 top
R156  82k  [R0603]  46.35,5.71 0 top
R157  18k  [R0603]  46.35,3.81 0 top
R158  150  [R0603]  130.81,3.81 90 top
R159  10k  [R0603]  113.03,2.54 270 top
R160  22  [R0603]  105.09,24.13 90 bottom
R161  10k  [R0603]  85.72,26.67 270 bottom
R162  10k  [R0603]  83.82,26.67 270 bottom
R163  237  [R0603]  37.47,30.48 270 bottom
R164  237  [R0603]  37.47,34.29 90 bottom
R165  10k  [R0603]  71.44,36.51 0 bottom
R166  10k  [R0603]  64.14,37.78 90 bottom
R167  39  [R0603]  119.38,43.18 0 bottom
R168  39  [R0603]  119.38,45.09 0 bottom
R169  10k  [R0603]  101.6,46.04 0 bottom
R170  10k  [R0603]  101.6,47.94 0 bottom
R171  237  [R0603]  37.47,48.26 270 bottom
R172  237  [R0603]  37.47,52.07 90 bottom
R173  100k  [R0603]  82.55,52.39 180 bottom
R174  49k9  [R0603]  19.05,52.7 0 bottom
R175  49k9  [R0603]  12.7,52.7 180 bottom
R176  10k  [R0603]  82.55,54.29 0 bottom
R177  0  [R0603]  136.53,56.2 270 bottom
R178  33  [R0603]  81.92,58.42 90 bottom
R179  10k  [R0603]  78.11,58.42 90 bottom
R180  0  [R0603]  140.97,60.96 180 bottom
R181  49k9  [R0603]  43.81,71.12 90 bottom
R182  237  [R0603]  76.2,73.66 270 bottom
R183  237  [R0603]  64.77,73.66 270 bottom
R184  237  [R0603]  76.2,77.47 90 bottom
R185  237  [R0603]  64.77,77.47 90 bottom
R186  49k9  [R0603]  43.81,77.47 270 bottom
R187  18k  [R0603]  159.38,87 180 bottom
R188  47k  [R0603]  155.57,87 0 bottom
R189  22  [R0603]  129.54,93.34 90 bottom
R190  22  [R0603]  127.64,93.34 270 bottom
R191  1k  [R0603]  163.19,95.25 270 bottom
R192  118k  [R0603]  170.18,96.52 0 bottom
R193  10k  [R0603]  159.38,99.69 0 bottom
R194  13k3  [R0603]  170.18,100.33 180 bottom
R195  10k  [R0603]  115.25,104.78 90 bottom
R196  10k  [R0603]  116.84,104.78 90 bottom
REF-OLED  NHD-2.7  [NHD-2.7]  244.47,15.24 180 top
S1  SDMMC06132  [06132]  150.5,25.4 0 top
SW1  PANASONIC-EVQ  [PANASONIC-EVQ]  109.86,4.45 270 top
TP-GND  [1X01]  165.1,107.31 0 top
U1  BAS70-04  [SOT23]  102.23,101.6 270 top
U2  LMR62014  [SOT23-5]  170.18,98.42 90 top
U3  BAS70-04  [SOT23]  102.23,97.79 270 top
U4  TPS2020  [SO08]  109.22,92.08 0 top
U5  LM2678  [TO263-7]  146.69,85.72 0 top
U6  ATMEGA32U4-AU  [TQFP44]  121.92,82.55 0 top
U7  ADP3339  [SOT223]  134.62,81.6 180 top
U8  TPA6111A2  [SO08]  11.43,78.11 270 top
U9  ADP3339  [SOT223]  97.16,73.03 90 top
U10  FDS9431A  [SO08]  101.6,62.23 0 top
U11  BAS70-04  [SOT23]  298.45,62.23 270 top
U12  BAS70-04  [SOT23]  311.15,62.23 270 top
U13  BAS70-04  [SOT23]  323.85,62.23 270 top
U14  BAS70-04  [SOT23]  336.55,62.23 270 top
U15  AT32UC3A0512  [LQFP144]  133.99,53.98 180 top
U16  CY62167EV30-Z  [TSOP48]  158.12,53.98 0 top
U17  AD1939  [SQFP-S-10X10-64]  62.87,41.27 0 top
U21  AD7923  [TSSOP16]  281.31,37.47 0 top
U22  LM4040M3  [SOT23]  286.38,35.56 90 top
U23  MT48LC32M16A2tg-75  [TSOP54]  102.23,18.41 0 top
U24  AD5686R  [TSSOP16]  68.58,17.78 270 top
U25  74HC14D  [SO14]  297.81,16.51 90 top
U26  SN74LVC2G14  [SOT23-6]  51.44,3.81 270 top
VDDINT  TPS-SMD-10R  [SMD-10R]  93.34,60.33 0 top
VDDOUT  TPS-SMD-10R  [SMD-10R]  136.21,66.67 180 top
X1  16mhz  [NX5032]  121.6,74.3 0 bottom
Y1  ASFL1-27mhz  [ASFL1]  80.01,60.96 0 top
Y2  12mhz  [HC49UP@1]  133.99,34.92 0 top
Y3  ASFL1-12.288mhz  [ASFL1]  70.17,33.02 0 top

## Tracks (layer width: path | path; a pad name or v marks a point on that pad's centre or on a via)
+3V3  (via drill 0.38, 0.6, 0.7)  (1 unrouted)
  Top 0.152: R134.2 R137.2 R138.2 R139.2 R141.2 R146.2 v131.44,8.89 | U16.47 152.87,62.7 152.4,62.23 151.13,62.23 148.91,64.45 v148.91,65.09
  Top 0.254: 3V3.TP v114.94,67.94 | v157.48,42.55 157.87,42.93 U16.12 | U16.37 157.87,61.98 v157.48,61.59 | R159.2 113.03,1.91 v114.94,1.91 | JP2.4 119.38,14.73 C111.1 | U21.15 279.68,41.55 280.04,41.91 280.04,42.42 C89.2 | U3.2 100.65,96.84 99.69,97.79 99.69,99.38 100.64,100.33 U1.2 101.28,100.65 107,100.65 109.22,102.87 v115.25,102.87 118.75,102.87 122.56,99.06 122.56,95.89 127,91.44 127,89.53 130.18,86.36 130.18,75.25 130.94,74.49 R40.1 | C68.2 360.81,59.56 355.19,65.19 LED8.A | v134.62,1.91 134.21,1.91 LED12.A
  Top 0.406: C89.2 280.16,43.31 280.67,43.81 C81.+ 284.48,45.09 v289.56,50.16 | C68.2 360.81,51.31 361.31,50.8 C70.+ 361.31,46.99 | S1.4 149.9,22.19 v150.5,21.59 | v294.64,45.09 328.93,45.09 330.83,46.99 361.31,46.99 | P9.3 365.12,46.99 361.31,46.99
  Top 0.61: v132.08,73.03 R40.1 | JP1.2 222.88,14.61 219.07,10.79 211.46,10.79 209.55,8.89 209.55,7.62 211.46,5.71 289.56,5.71 290.83,6.99 302.26,6.99 305.44,3.81 364.49,3.81 371.48,10.79 371.48,42.55 370.2,43.81 368.3,43.81 P9.3
  Bottom 0.254: C156.1 v157.48,42.55 | C195.1 v157.48,61.59 | R196.1 R195.1 v115.25,102.87
  Bottom 0.406: v289.56,50.16 v294.64,45.09
  pour power (isolate 0.305): 135.25,73.03 135.25,75.56 133.99,76.83 113.67,76.83 112.39,75.56 114.94,73.03 114.94,0 173.99,0 173.99,110.49 156.84,110.49 156.84,70.48 155.57,69.22 147.96,69.22 147.96,41.27 145.41,38.73 123.83,38.73 120.02,42.55 120.02,64.14 123.83,67.94 130.18,67.94
+3V3A  (via drill 0.38, 0.6)
  Top 0.254: C102.1 v53.34,33.97 53.34,33.21 R126.2 | U17.51 58.31,44.02 v58.74,44.45 | U17.45 60.62,44.48 v60.64,44.45 | U17.62 58.53,38.52 v58.74,38.42 | U17.5 61.12,36.98 v61.28,37.15 | IC10.8 17.78,48.26 v16.51,46.99 | IC9.8 40.64,45.21 C78.2 v41.91,45.09 | IC4.8 48.26,76.2 v49.53,74.93 | IC12.8 40.64,27.43 C107.2 v41.91,27.3 | IC2.8 61.59,80.52 C17.2 v60.33,80.64 | IC3.8 73.03,80.52 C19.2 v71.75,80.64 | IC8.8 51.44,54.61 50.48,53.66 50.04,53.66 | 50.04,53.66 C67.2 | 50.04,53.66 49.85,53.66 v49.85,54.61
  Top 0.406: L2.1 v92.71,83.82 92.39,83.5 C14.+
  Bottom 0.254: C160.1 58.61,44.58 v58.74,44.45 | 59.88,46.55 C162.1 59.88,46.45 60.62,45.72 60.62,44.48 v60.64,44.45 | 57.66,37.97 C150.1 57.59,38.1 58.42,38.1 v58.74,38.42 | v61.28,37.15 61.28,36.07 C144.1 | v16.51,46.99 16.51,48.13 C171.2 | v49.53,74.93 48.39,74.93 C215.2
  pour power: 0,110.49 95.25,110.49 95.25,81.28 89.53,75.56 87,75.56 64.14,52.7 64.14,30.48 70.48,24.13 70.48,0 0,0
+3V3C  (via drill 0.38, 0.6)
  Top 0.152: v84.45,52.39 82.23,54.61 81.28,54.61 80.01,55.88 80.01,62.87 79.38,63.5 v78.74,63.5 | Y3.4 v68.9,35.88 | R143.1 v71.75,11.43 | v87,47.94 v99.69,47.94 | U24.11 74.64,16.8 v74.93,16.51 | U17.31 67.23,44.52 v66.99,44.77
  Top 0.254: U23.49 95.83,22.91 v96.52,22.23 | U23.43 100.64,22.24 v100.65,22.23 | U23.9 98.23,10.98 v98.74,10.48 | U23.14 102.23,11.11 v102.87,10.48 | U23.27 112.64,11.19 v113.35,10.48 | U23.1 91.83,11.67 92.39,11.11 93.66,11.11 | v93.66,10.48 93.66,11.11 | U23.3 93.44,11.85 C128.2 93.66,11.11 | v78.74,63.5 Y1.4 | v111.76,66.67 3V3C.TP | R38.2 R37.2 88.71,77.6 88.27,77.15 88.27,72.39 85.72,69.85 83.19,69.85 81.28,67.94 v81.28,66.67 | U17.17 68,37.52 v67.31,36.83 | U17.32 67.25,45.02 v66.99,44.77
  Top 0.406: v109.22,73.03 R43.1 107.31,73.15 107.31,73.66 105.41,75.56 105.41,81.6 103.19,83.82 L2.2
  Bottom 0.152: R173.2 v84.45,52.39 87,49.85 v87,47.94 | v68.9,35.88 69.53,36.51 R165.2 72.2,34.99 C142.1 | R169.2 R170.2 v99.69,47.94 | R162.2 R161.2 86.55,25.91 v87,26.35
  Bottom 0.254: C133.2 v96.52,22.23 | C132.2 v100.65,22.23 | C127.2 98.11,11.11 v98.74,10.48 | C126.2 102.23,11.11 v102.87,10.48 | C125.2 112.71,11.11 v113.35,10.48 | v93.66,10.48 C128.2 C129.2 | v78.74,63.5 78.74,60.96 78.11,60.33 R179.2 C193.1 | 66.17,36.83 C148.1 66.23,36.83 v67.31,36.83 | C158.1 68.14,43.94 67.63,44.45 67.31,44.45 v66.99,44.77
  pour power: 109.86,74.3 111.12,74.3 113.67,71.75 113.67,0 71.75,0 71.75,24.77 65.41,31.11 65.41,51.44 75.56,61.59 75.56,28.57 76.83,27.3 107.31,27.3 108.58,28.57 108.58,59.05 107.31,60.33 76.83,60.33 76.83,62.87 83.19,69.22 104.78,69.22
+5V  (via drill 0.38, 0.6, 0.7)  (1 unrouted)
  Top 0.254: 113.03,93.34 R7.2 v113.03,92.08 R13.2 113.03,90.81 | U4.3 109.86,88.27 v109.22,87.63 108.58,88.27 U4.2 | 297.18,10.92 C115.2 | R155.1 R156.1 v44.45,5.71 | v53.66,3.81 U26.5 | U24.5 v64.46,17.45 v64.45,17.46 | U24.10 69.5,16.16 v67.94,14.61 | R135.1 v304.8,15.88 | v304.8,10.79 v304.8,8.26 | U6.14 119.52,77.97 v119.38,78.11 | U6.24 128.88,79.35 v129.22,79.69 | U6.34 125.92,87.12 v125.73,87 | v114.62,85.41 114.96,85.75 U6.2 117.18,85.75 117.92,86.49 U6.44 117.92,89.34 118.11,89.53 119.38,89.53 119.52,89.39 U6.42 | 5V.TP 111.12,74.3 108.58,74.3 v107.31,75.56
  Top 0.406: C23.2 v98.74,78.11 | U9.3 100.25,78.03 C23.2 | C23.2 C24.+ | C120.+ 365.76,10.16 365.25,10.67 C114.2 | 261.62,6.99 281.94,6.99 | 281.94,6.99 288.93,6.99 290.19,8.26 297.18,8.26 | 297.18,8.26 v304.8,8.26 | 261.62,6.99 241.3,6.99 | 241.3,6.99 221.62,6.99 220.98,7.62 R147.1 | 241.3,6.99 R149.1 | R151.1 261.62,6.99 | 281.94,6.99 R153.1 | E3.P$5 297.18,38.61 C98.2 298.32,35.69 298.45,35.56 | E4.P$5 332.74,38.61 C99.2 333.88,36.7 332.74,35.56 298.45,35.56 | E1.P$5 350.52,8.13 C122.2 351.66,5.21 351.79,5.08 | E2.P$5 314.96,8.13 C121.2 316.1,5.21 316.23,5.08 | 298.45,35.56 294,35.56 v292.74,34.29 | v292.74,12.06 293.37,12.7 U25.14 296.55,12.7 297.18,12.06 297.18,10.92 297.18,8.26 | 168.91,99.41 U2.4 U2.5 167.64,97.47 167.32,97.79 C1.1 167,96.52 167,93.92 L1.P$1 167.26,90.42 165.74,88.9 165.74,88.27 161.29,83.82 | v171.45,10.79 173.35,12.7 173.35,43.18 P8.4
  Top 0.61: U7.3 132.31,86.13 131.44,87 C6.2 v131.44,90.17 | v168.28,76.83 161.29,83.82 160.71,83.82 L4.2 158.81,83.88 158.75,82.55 154.31,78.11 v153.03,78.11 149.86,78.11 149.22,78.74 U5.6 | L5.2 365.12,78.74 365.76,78.11 v367.67,78.11 | v304.8,8.26 307.98,5.08 316.23,5.08 351.79,5.08 363.86,5.08 365.76,6.99 C120.+ v367.03,8.89
  Bottom 0.254: 66.86,17.46 v64.45,17.46 | 66.86,17.46 C130.1 67.94,16.51 v67.94,14.61 | C131.+ 67.31,17.91 66.86,17.46 | v304.8,15.88 v304.8,10.79 | v119.38,78.11 119.38,79.25 C223.2 119.25,80.14 118.75,80.64 C225.+ | C226.2 124.59,85.85 v125.73,87
  Bottom 0.406: v292.74,12.06 v292.74,34.29 | v44.45,5.71 51.75,5.71 | v171.45,10.79 161.29,0.64 102.87,0.64 100.97,2.54 100.97,4.45 99.06,6.35 96.52,6.35 94.61,4.45 94.61,2.54 92.71,0.64 54.61,0.64 53.66,1.59 v53.66,3.81 51.75,5.71 | 51.75,5.71 60.64,14.61 v67.94,14.61
  Bottom 0.61: v168.28,76.83 173.35,71.75 173.35,46.99 P8.4 | v131.44,90.17 C6.2 | 371.48,45.09 371.48,13.34 v367.03,8.89 | P9.4 371.48,45.09 | 371.48,45.09 371.48,74.3 v367.67,78.11
  Bottom 0.813: C229.+ C28.+ 154.31,76.83 v153.03,78.11
  pour power (isolate 0.305): 154.31,70.48 144.15,70.48 136.53,78.11 111.12,78.11 103.5,70.48 84.45,70.48 88.27,74.3 90.81,74.3 96.52,80.01 96.52,110.49 155.57,110.49 155.57,71.75
+5VA  (via drill 0.38)  (1 unrouted)
  Top 0.254: U21.5 281.63,33.65 281.94,33.34 | C104.2 282.57,32.7 281.94,33.34 | U21.6 282.28,33.68 281.94,33.34 | U13.2 319.72,61.28 v318.13,59.69 | U12.2 305.75,61.28 v305.44,60.96 | U14.2 333.69,61.28 v330.83,58.42 | v297.18,58.42 297.18,61.11 U11.2 | C8.+ 12.7,83.19 12.19,82.68 C15.2 12.06,81.79 v12.06,80.01 U8.8 | R133.2 212.22,24 211.46,24.77 210.69,24.77 | 210.69,24.77 IC13.8 207.65,24.77 206.88,24 R132.2 v206.38,22.23 | C110.2 210.69,24.77 | IC5.8 v12.06,72.07 12.06,73.85 C32.2
  Top 0.406: R115.1 285.62,40.51 286.38,41.27 290.19,41.27 | 365.06,80.71 L5.1 | IC11.8 210.82,44.45 209.68,45.59 C76.2 209.55,46.48 v209.55,50.8 v209.55,55.24 | IC6.8 245.75,60.33 244.6,61.47 C53.2 244.47,62.36 v244.47,63.5 | IC7.8 266.06,60.33 264.92,61.47 C55.2 264.92,62.74 v264.16,63.5 | 248.28,32.38 248.16,32.51 R122.1 248.16,34.8 250.19,36.83 250.19,39.37 250.82,40.01 IC15.8 252.16,41.46 C91.2 | 264.8,32.38 264.67,32.51 R124.1 264.67,34.8 266.7,36.83 266.7,39.37 267.33,40.01 IC14.8 268.67,41.46 C92.2 | v292.1,53.34 v279.4,66.04 277.71,67.72 LED7.A | LED5.A 256.76,67.72 v258.44,66.04 | IC16.8 235.65,41.46 C90.2
  Top 0.61: C104.2 283.08,32.51 283.85,31.75 C105.+ v287.65,31.75 290.19,34.29 290.19,41.27 290.19,42.55 v296.55,48.9 v301.62,53.98 303.53,55.88 v305.44,55.88 v318.13,55.88 v330.83,55.88 335.28,55.88 349.25,69.85 349.25,78.74 353.06,82.55 363.86,82.55 365.06,81.34 365.06,80.71 | v276.23,29.21 273.05,32.38 264.8,32.38 248.28,32.38 240.03,32.38 237.49,34.92 237.49,39.37 236.85,40.01 IC16.8
  Bottom 0.254: v305.44,55.88 v305.44,60.96 | v318.13,55.88 v318.13,59.69 | v330.83,55.88 v330.83,58.42 | v301.62,53.98 v297.18,58.42
  Bottom 0.406: P6.6 14.61,69.53 v12.06,72.07 v12.06,80.01 | P7.6 211.46,59.05 211.46,57.15 v209.55,55.24 | v244.47,63.5 248.28,63.5 250.82,66.04 v258.44,66.04 260.99,63.5 v264.16,63.5 268.61,63.5 271.14,66.04 v279.4,66.04 | v292.1,53.34 v296.55,48.9
  Bottom 0.61: v287.65,31.75 285.12,29.21 v276.23,29.21 276.23,24.77 270.51,19.05 209.55,19.05 v206.38,22.23 200.03,28.57 200.03,48.9 201.93,50.8 v209.55,50.8
+12V  (via drill 0.38)  (1 unrouted)
  Top 0.254: IC1.4 v352.74,95.89 C2.1
  Top 0.406: v167,87 D1.C 168.91,86.36 C10.+
  Top 0.61: P8.2 171.45,77.47 168.91,80.01 C10.+ | v360.05,90.81 369.57,81.28 P9.2
  Bottom 0.406: v360.05,90.81 357.82,90.81 v352.74,95.89 | C228.2 R192.2 169.42,96.39 167,93.98 v167,87
A-A1
  Top 0.152: U15.118 145.54,49.73 146.05,49.21 147.32,49.21 147.96,49.85 154.62,49.85 163.87,59.09 U16.25
A-A2
  Top 0.152: U15.114 146.47,47.73 148.27,49.53 160.66,49.53 163.87,46.32 U16.24
A-A3
  Top 0.152: U15.112 146.31,46.73 147,46.04 147.32,46.04 148.27,46.99 148.27,48.9 148.59,49.21 160.34,49.21 163.37,46.19 U16.23
A-A4
  Top 0.152: U15.110 145.41,45.73 145.73,45.4 147.32,45.4 148.59,46.67 148.59,48.58 148.91,48.9 160.02,48.9 162.87,46.05 U16.22
A-A5
  Top 0.152: U15.107 142.24,42.55 142.56,42.23 144.78,42.23 148.91,46.35 148.91,48.26 149.22,48.58 159.7,48.58 162.37,45.91 U16.21
A-A6
  Top 0.152: U15.105 141.24,42.6 141.92,41.91 145.1,41.91 149.22,46.04 149.22,47.94 149.54,48.26 159.38,48.26 161.87,45.78 U16.20
A-A7
  Top 0.152: U15.103 140.24,42.33 140.97,41.59 145.41,41.59 149.54,45.72 149.54,47.62 149.86,47.94 159.07,47.94 161.37,45.65 U16.19
A-A8
  Top 0.152: U15.101 139.24,42.38 140.34,41.27 145.73,41.27 149.86,45.4 149.86,47.31 150.18,47.62 158.75,47.62 160.87,45.51 U16.18
A-A9
  Top 0.152: U15.99 138.24,42.42 139.7,40.96 146.05,40.96 150.18,45.09 150.18,46.99 150.5,47.31 154.62,47.31 155.87,46.06 U16.8
A-A10